# Altium schematic sheet power.SchDoc: Abacus main PCB - Power
size A4; DrawnBy: Posheng Cheng; SheetNumber: 4; SheetTotal: 4
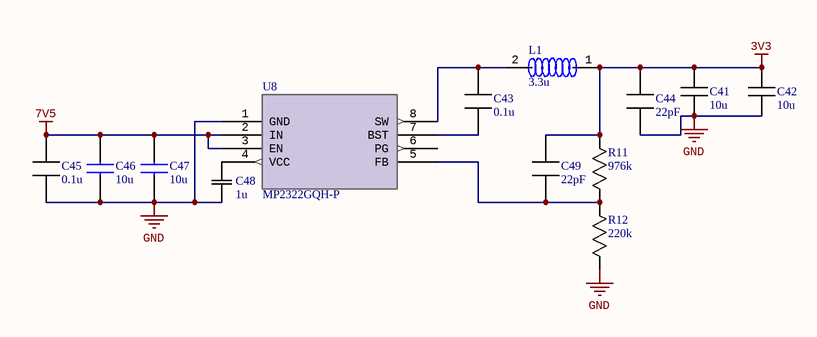
[diagram p0: power.SchDoc]

## Parts
C41  10u  [CAPC17595_87N_KEM]
C42  10u  [CAPC17595_87N_KEM]
C43  0.1u  [CAPC17595_87N_KEM]
C44  22pF  [CAPC17595_87N_KEM]
C45  0.1u  [CAPC17595_87N_KEM]
C46  10u  [CAPC2012X145N]
C47  10u  [CAPC2012X145N]
C48  1u  [CAP_CC0201_YAG]
C49  22pF  [CAPC17595_87N_KEM]
L1  3.3u  [MPL-AT2512-XXX]
R11  976k  [RC0603N_PAN]
R12  220k  [RC0603N_PAN]
U8  MP2322GQH-P  [QFN-8_1p5MMx2MM_MNP]

## Nets
3V3: C41.2 C42.2 C44.1 C49.1 L1.1 R11.1
7V5: C45.2 C46.2 C47.2 U8.2(IN) U8.3(EN)
GND: C41.1 C42.1 C44.2 C45.1 C46.1 C47.1 C48.1 R12.2 U8.1(GND)
NetC43_1: C43.1 L1.2 U8.8(SW)
NetC43_2: C43.2 U8.7(BST)
NetC48_2: C48.2 U8.4(VCC)
NetC49_2: C49.2 R11.2 R12.1 U8.5(FB)

Not connected (* = marked no-connect by the designer): U8 6(PG)

## Library data of the parts
C41 C42 = CC0603KRX5R5BB106: CC0603KRX5R5BB106 10 uF, 10%, 6.3 VDC, X5R; Manufacturer_Part_Number: CC0603KRX5R5BB106
C43 C45 = CC0603KRX7R9BB104: 50V X7R 0603; Manufacturer_Part_Number: CC0603KRX7R9BB104
C44 C49 = C0603C220J1GACTU: 22pF C0G, 22 pF, 5%, 100 VDC, C0G; Manufacturer_Part_Number: C0603C220J1GACTU
C46 C47 = CC0805KKX5R8BB106: Multilayer Ceramic Capacitors MLCC - SMD/SMT The factory is currently not accepting orders for this product.10 uF,25V; Manufacturer_Name: YAGEO; Geometry.Height: 1.45mm; Manufacturer_Part_Number: CC0805KKX5R8BB106; Mouser Part Number: 603-CC805KKX5R8BB106; Mouser Price/Stock: https://www.mouser.co.uk/ProductDetail/YAGEO/CC0805KKX5R8BB106?qs=57cj7OiSijm89pM64t1AGQ%3D%3D; Arrow Part Number: CC0805KKX5R8BB106; Arrow Price/Stock: https://www.arrow.com/en/products/cc0805kkx5r8bb106/yageo?utm_currency=USD&region=nac; Datasheet Link: https://www.yageo.com/upload/media/product/productsearch/datasheet/mlcc/UPY-GPHC_X5R_4V-to-50V_27.pdf
C48 = CMP-001-00084-1: No Description Available; Manufacturer_Name: Yageo; Design Item ID: CC0201MRX5R5BB105; Manufacturer_Part_Number: CC0201MRX5R5BB105; Source: CC0201MRX5R5BB105.SchLib; Copyright: Copyright (C) 2025 Ultra Librarian. All rights reserved.
L1 = MPL-AT2512-3R3: Low-Profile Molded Inductor 3.3µH; Manufacturer_Part_Number: MPL-AT2512-3R3
R11 = RT0603BRD07976KL: Manufacturer_Part_Number: RT0603BRD07976KL
R12 = RT0603BRD07220KL: Manufacturer_Part_Number: RT0603BRD07220KL
U8 = MP2322GQH-P: 1A 3V to 22V 5Î¼A IQ Synchronous Step-Down Converter in a QFN-8 (1.5mmx2mm) Package; Manufacturer_Name: Monolithic Power Systems; Copyright: Copyright (C) 2025 Ultra Librarian. All rights reserved.; Manufacturer_Part_Number: MP2322GQH-P; Datasheet: https://www.monolithicpower.com/en/documentview/productdocument/index/version/2/document_type/Datasheet/lang/en/sku/MP2322; RefDes: RefDes; Type: Type